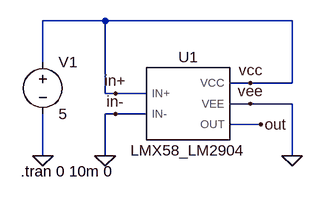
[diagram p0: schematic 4-20mA.asc]
4-20mA.asc, the LTspice schematic file:
Version 4
SHEET 1 880 680
WIRE 48 48 -48 48
WIRE 336 48 48 48
WIRE -48 112 -48 48
WIRE 272 144 240 144
WIRE 336 144 336 48
WIRE 336 144 272 144
WIRE 48 160 48 48
WIRE 64 160 48 160
WIRE 112 160 64 160
WIRE 272 176 240 176
WIRE 336 176 272 176
WIRE 64 192 48 192
WIRE 112 192 64 192
WIRE 288 208 240 208
WIRE -48 256 -48 192
WIRE 48 256 48 192
WIRE 336 256 336 176
FLAG 48 256 0
FLAG -48 256 0
FLAG 336 256 0
FLAG 288 208 out
FLAG 272 144 vcc
FLAG 272 176 vee
FLAG 64 192 in-
FLAG 64 160 in+
SYMBOL AutoGenerated\\LMX58_LM2904 176 176 R0
SYMATTR InstName U1
SYMBOL voltage -48 96 R0
WINDOW 123 0 0 Left 0
WINDOW 39 0 0 Left 0
SYMATTR InstName V1
SYMATTR Value 5
TEXT -82 280 Left 2 !.tran 0 10m 0

The netlist it stands for:
* 4-20mA.asc
XU1 in+ 0 in+ 0 out LMX58_LM2904  ; pins IN+ IN- VCC VEE OUT
V1 in+ 0 5
.tran 0 10m 0
.lib C:\Users\gabri\Desktop\SNOM268A\LMx58_LM2904.CIR
.backanno
.end